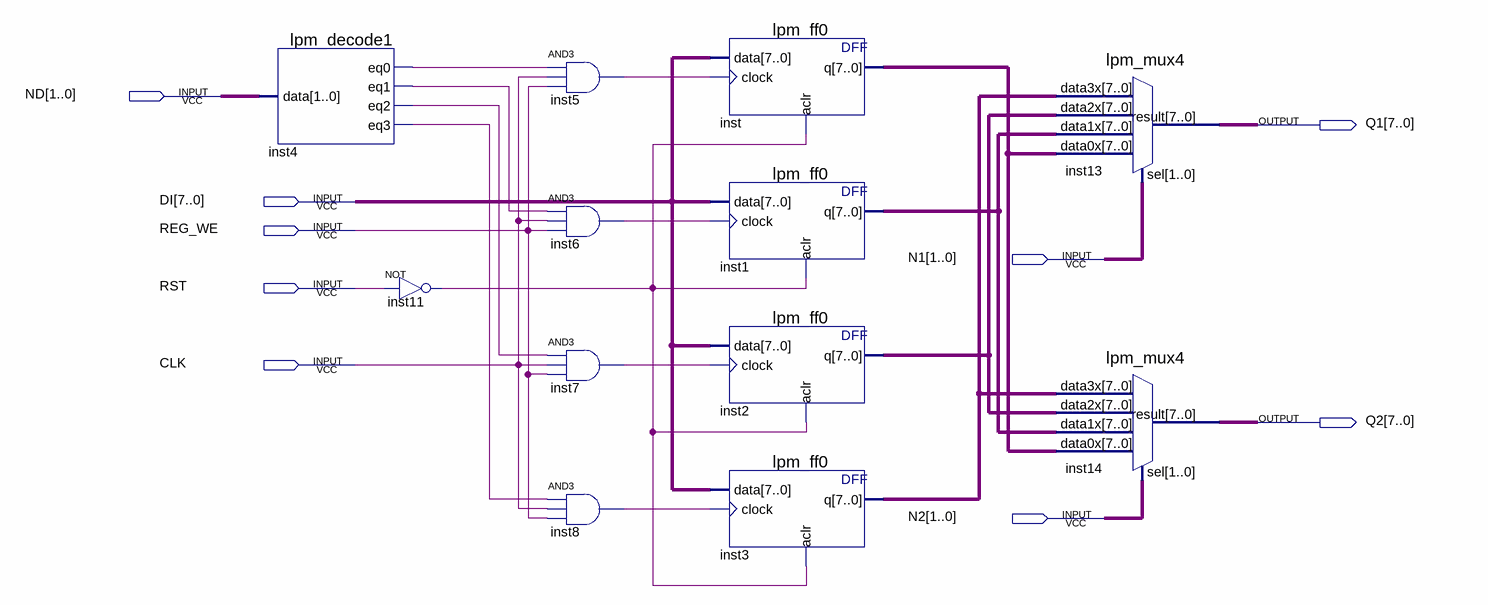
[diagram p0: schematic sheet]
// Quartus schematic reg4_8.bdf as structural Verilog: 12 symbols, 9 pins
module reg4_8 (
  input  [1:0] ND,
  input  [7:0] DI,
  input  REG_WE,
  input  [1:0] N1,
  input  RST,
  input  CLK,
  input  [1:0] N2,
  output [7:0] Q1,
  output [7:0] Q2
);

  wire inst4_eq0, inst4_eq1, inst4_eq2, inst4_eq3, inst5_out, inst6_out, inst7_out, inst8_out, inst11_out;
  wire [7:0] inst1_q, inst2_q, inst3_q, inst_q;

  lpm_decode1 inst4 (.data(ND), .eq0(inst4_eq0), .eq1(inst4_eq1), .eq2(inst4_eq2), .eq3(inst4_eq3));
  not inst11 (inst11_out, RST);
  and inst5 (inst5_out, inst4_eq0, CLK, REG_WE);
  and inst6 (inst6_out, inst4_eq1, CLK, REG_WE);
  and inst7 (inst7_out, inst4_eq2, CLK, REG_WE);
  and inst8 (inst8_out, inst4_eq3, CLK, REG_WE);
  lpm_ff0 inst (.data(DI), .clock(inst5_out), .aclr(inst11_out), .q(inst_q));
  lpm_ff0 inst1 (.data(DI), .clock(inst6_out), .aclr(inst11_out), .q(inst1_q));
  lpm_ff0 inst2 (.data(DI), .clock(inst7_out), .aclr(inst11_out), .q(inst2_q));
  lpm_ff0 inst3 (.data(DI), .clock(inst8_out), .aclr(inst11_out), .q(inst3_q));
  lpm_mux4 inst13 (.data3x(inst3_q), .data2x(inst2_q), .data1x(inst1_q), .data0x(inst_q), .sel(N1), .result(Q1));
  lpm_mux4 inst14 (.data3x(inst3_q), .data2x(inst2_q), .data1x(inst1_q), .data0x(inst_q), .sel(N2), .result(Q2));
endmodule
